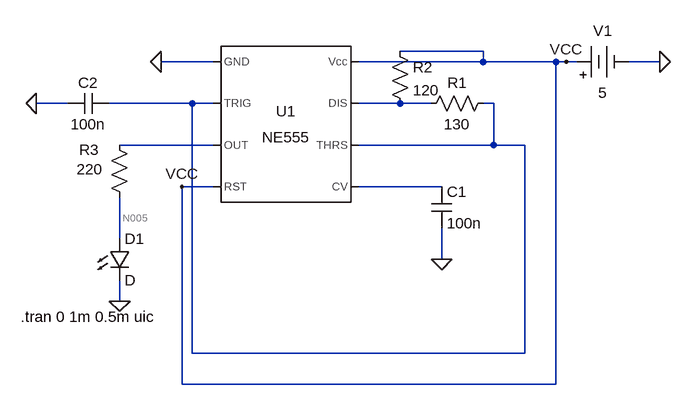
[diagram p0: schematic 555_astabil_1.asc]
555_astabil_1.asc, the LTspice schematic file:
Version 4.1
SHEET 1 880 680
WIRE 432 -224 304 -224
WIRE 16 -208 -64 -208
WIRE 432 -208 432 -224
WIRE 432 -208 240 -208
WIRE 544 -208 432 -208
WIRE 560 -208 544 -208
WIRE 576 -208 560 -208
WIRE 704 -208 656 -208
WIRE -208 -144 -256 -144
WIRE -16 -144 -144 -144
WIRE 16 -144 -16 -144
WIRE 304 -144 240 -144
WIRE 352 -144 304 -144
WIRE 448 -144 432 -144
WIRE 16 -80 -128 -80
WIRE 448 -80 448 -144
WIRE 448 -80 240 -80
WIRE 496 -80 448 -80
WIRE 16 -16 -32 -16
WIRE 368 -16 240 -16
WIRE -128 64 -128 0
WIRE 368 96 368 48
WIRE -128 160 -128 128
WIRE -16 240 -16 -144
WIRE 496 240 496 -80
WIRE 496 240 -16 240
WIRE -32 288 -32 -16
WIRE 544 288 544 -208
WIRE 544 288 -32 288
FLAG 560 -208 VCC
FLAG -32 -16 VCC
FLAG 704 -208 0
FLAG -64 -208 0
FLAG 368 96 0
FLAG -256 -144 0
FLAG -128 160 0
SYMBOL Misc\\NE555 128 -112 R0
SYMATTR InstName U1
SYMBOL Misc\\battery 560 -208 R270
WINDOW 0 32 56 VTop 2
WINDOW 3 -32 56 VBottom 2
WINDOW 123 0 0 Left 0
WINDOW 39 0 0 Left 0
SYMATTR InstName V1
SYMATTR Value 5
SYMBOL cap 352 -16 R0
SYMATTR InstName C1
SYMATTR Value 100n
SYMBOL cap -144 -160 R90
WINDOW 0 0 32 VBottom 2
WINDOW 3 32 32 VTop 2
SYMATTR InstName C2
SYMATTR Value 100n
SYMBOL res 448 -160 R90
WINDOW 0 0 56 VBottom 2
WINDOW 3 32 56 VTop 2
SYMATTR InstName R1
SYMATTR Value 130
SYMBOL res 288 -240 R0
SYMATTR InstName R2
SYMATTR Value 120
SYMBOL res -144 -96 R0
WINDOW 0 -46 23 Left 2
WINDOW 3 -50 53 Left 2
SYMATTR InstName R3
SYMATTR Value 220
SYMBOL LED -144 64 R0
SYMATTR InstName D1
TEXT -280 184 Left 2 !.tran 0 1m 0.5m uic

The netlist it stands for:
* 555_astabil_1.asc
X§U1 0 N001 N003 VCC N004 N001 N002 VCC NE555  ; pins GND TRIG OUT RST CV THRS DIS Vcc
V1 VCC 0 5
C1 N004 0 100n
C2 N001 0 100n
R1 N001 N002 130
R2 VCC N002 120
R3 N003 N005 220
D1 N005 0 D
.model D D
.lib standard.dio
.tran 0 1m 0.5m uic
.lib NE555.sub
.backanno
.end

* Results of the author's LTspice run, read from the files saved beside the schematic
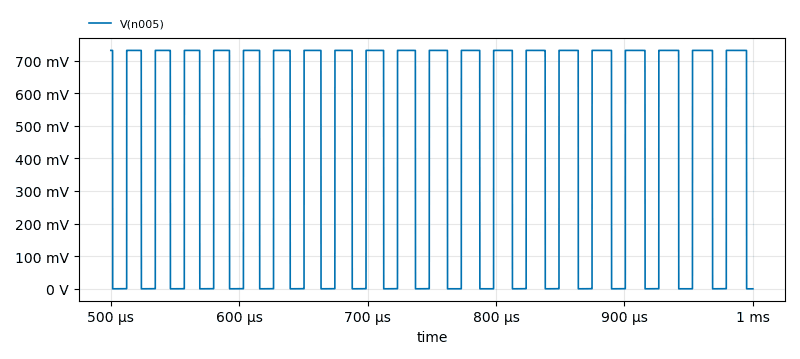
[diagram p1: Transient Analysis of 555_astabil_1.asc, plotted from the saved traces]
* Transient Analysis, 1 run:
*   V(n005): min 30 µV, max 731.2 mV, average 407.3 mV, rms 545.6 mV, last 30 µV